# EAGLE design 6to10 (EAGLE 6.5.0)
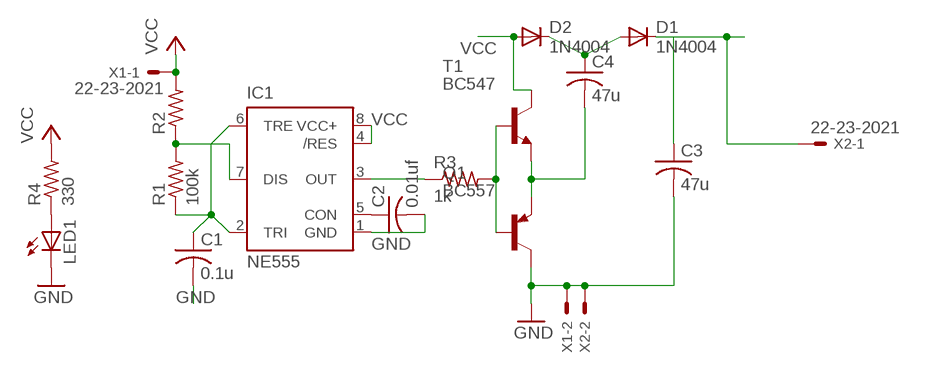
[diagram p0: schematic, sheet 1]

## Parts
C1  0.1u  C-US050-025X075  [C050-025X075]
C2  0.01uf  C-US050-025X075  [C050-025X075]
C3  47u  C-US050-075X075  [C050-075X075]
C4  47u  C-US050-075X075  [C050-075X075]
D1  1N4004  [DO41-10]
D2  1N4004  [DO41-10]
IC1  NE555  [DIL-08]
LED1  LED5MM  [LED5MM]
Q1  BC557  [TO92]
R1  100k  R-US_0204/7  [0204/7]
R2  R-US_0204/7  [0204/7]
R3  1k  R-US_0204/7  [0204/7]
R4  330  R-US_0204/7  [0204/7]
T1  BC547  [TO92]
X1  22-23-2021  [22-23-2021]
X2  22-23-2021  [22-23-2021]

## Nets
GND: C1.2 C2.2 C3.2 IC1.1(GND) LED1.K(C) Q1.3(C) X1.2 X2.2
N$1: C1.1 IC1.2(TRI) IC1.6(TRE) R1.1
N$2: C2.1 IC1.5(CON)
N$3: IC1.7(DIS) R1.2 R2.1
N$4: IC1.3(OUT) R3.1
N$5: C4.1 D1.A D2.C
N$6: C3.1 D1.C X2.1
N$7: Q1.2(B) R3.2 T1.2(B)
N$8: C4.2 Q1.1(E) T1.1(E)
N$9: LED1.A R4.1
VCC: D2.A IC1.4(/RES) IC1.8(VCC+) R2.2 R4.2 T1.3(C) X1.1

## Library data of the parts
C1-C4 = rcl:C-US: CAPACITOR, American symbol
D1 D2 = diode:1N4004: DIODE general purpose rectifier, 1 A
IC1 = st-microelectronics:NE555: General purpose bipolar Timer; MF: Arrow Electronics; MPN: NE555N; OC_FARNELL: 1467742; OC_NEWARK: 89K1486
LED1 = led:LED: LED OSRAM: - CHIPLED LG R971, LG N971, LY N971, LG Q971, LY Q971, LO R971, LY R971 LH N974, LH R974 LS Q976, LO Q976, LY Q976 LO Q996 - Hyper CHIPLED LW Q18S LB Q993, LB Q99A, LB R99A - SideLED LS A670, LO A670, LY A670, LG A670, LP A670 LB A673, LV A673, LT A673, LW A673 LH A674 LY A675 LS A676, LA A676, LO A676, LY A676, LW A676 LS A679, LY A679, LG A679 - Hyper Micro SIDELED® LS Y876, LA Y876, LO Y876, LY Y876 LT Y87S - SmartLED LW L88C, LW L88S LB L89C, LB L89S, LG L890 LS L89K, LO L89K, LY L89K LS L896, LA L896, LO L896, LY L896 - TOPLED LS T670, LO T670, LY T670, LG T670, LP T670 LSG T670, LSP T670, LSY T670, LOP T670, LYG T670 LG T671, LOG T671, LSG T671 LB T673, LV T673, LT T673, LW T673 LH T674 LS T676, LA T676, LO T676, LY T676, LB T676, LH T676, LSB T676, LW T676 LB T67C, LV T67C, LT T67C, LS T67K, LO T67K, LY T67K, LW E67C LS E67B, LA E67B, LO E67B, LY E67B, LB E67C, LV E67C, LT E67C LW T67C LS T679, LY T679, LG T679 LS T770, LO T770, LY T770, LG T770, LP T770 LB T773, LV T773, LT T773, LW T773 LH T774 LS E675, LA E675, LY E675, LS T675 LS T776, LA T776, LO T776, LY T776, LB T776 LHGB T686 LT T68C, LB T68C - Hyper Mini TOPLED® LB M676 - Mini TOPLED Santana® LG M470 LS M47K, LO M47K, LY M47K Source: http://www.osram.convergy.de LUXEON: - LUMILED® LXK2-PW12-R00, LXK2-PW12-S00, LXK2-PW14-U00, LXK2-PW14-V00 LXK2-PM12-R00, LXK2-PM12-S00, LXK2-PM14-U00 LXK2-PE12-Q00, LXK2-PE12-R00, LXK2-PE12-S00, LXK2-PE14-T00, LXK2-PE14-U00 LXK2-PB12-K00, LXK2-PB12-L00, LXK2-PB12-M00, LXK2-PB14-N00, LXK2-PB14-P00, LXK2-PB14-Q00 LXK2-PR12-L00, LXK2-PR12-M00, LXK2-PR14-Q00, LXK2-PR14-R00 LXK2-PD12-Q00, LXK2-PD12-R00, LXK2-PD12-S00 LXK2-PH12-R00, LXK2-PH12-S00 LXK2-PL12-P00, LXK2-PL12-Q00, LXK2-PL12-R00 Source: www.luxeon.com KINGBRIGHT: KA-3528ASYC Source: www.kingbright.com
Q1 = transistor-pnp:BC557: PNP Transistor
R1-R4 = rcl:R-US_: RESISTOR, American symbol
T1 = transistor:BC547: NPN TRANSISTOR
X1 X2 = con-molex:22-23-2021: .100" (2.54mm) Center Header - 2 Pin; MF: MOLEX; MPN: 22-23-2021; OC_FARNELL: 1462926; OC_NEWARK: 25C3832

## Board
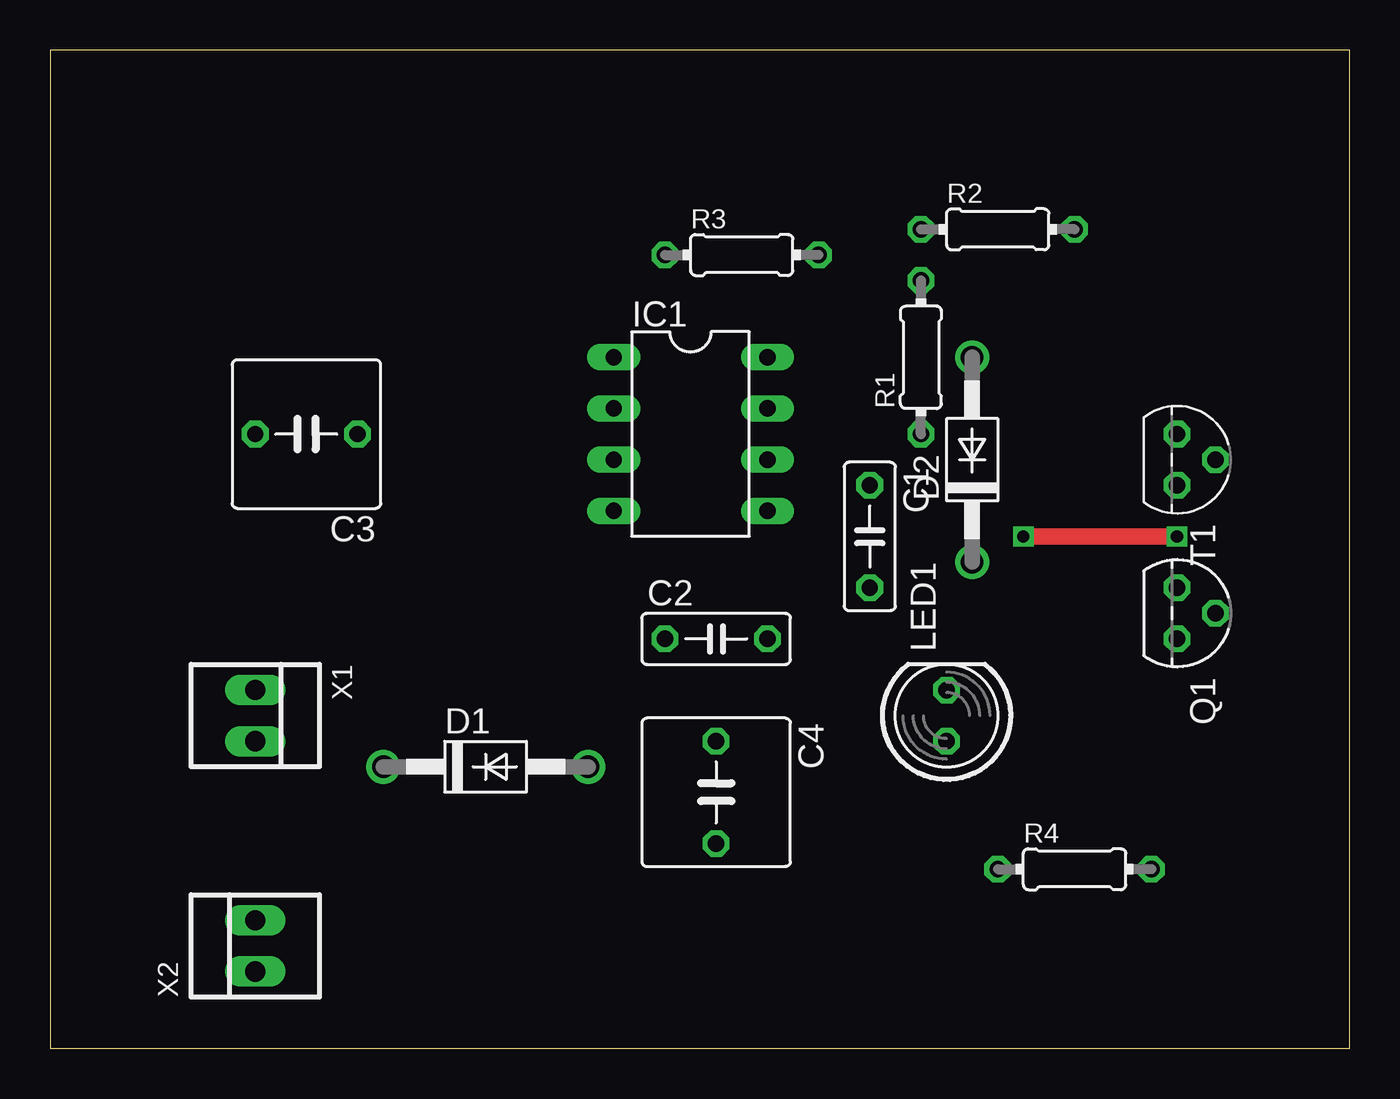
[diagram p1: board, top side]
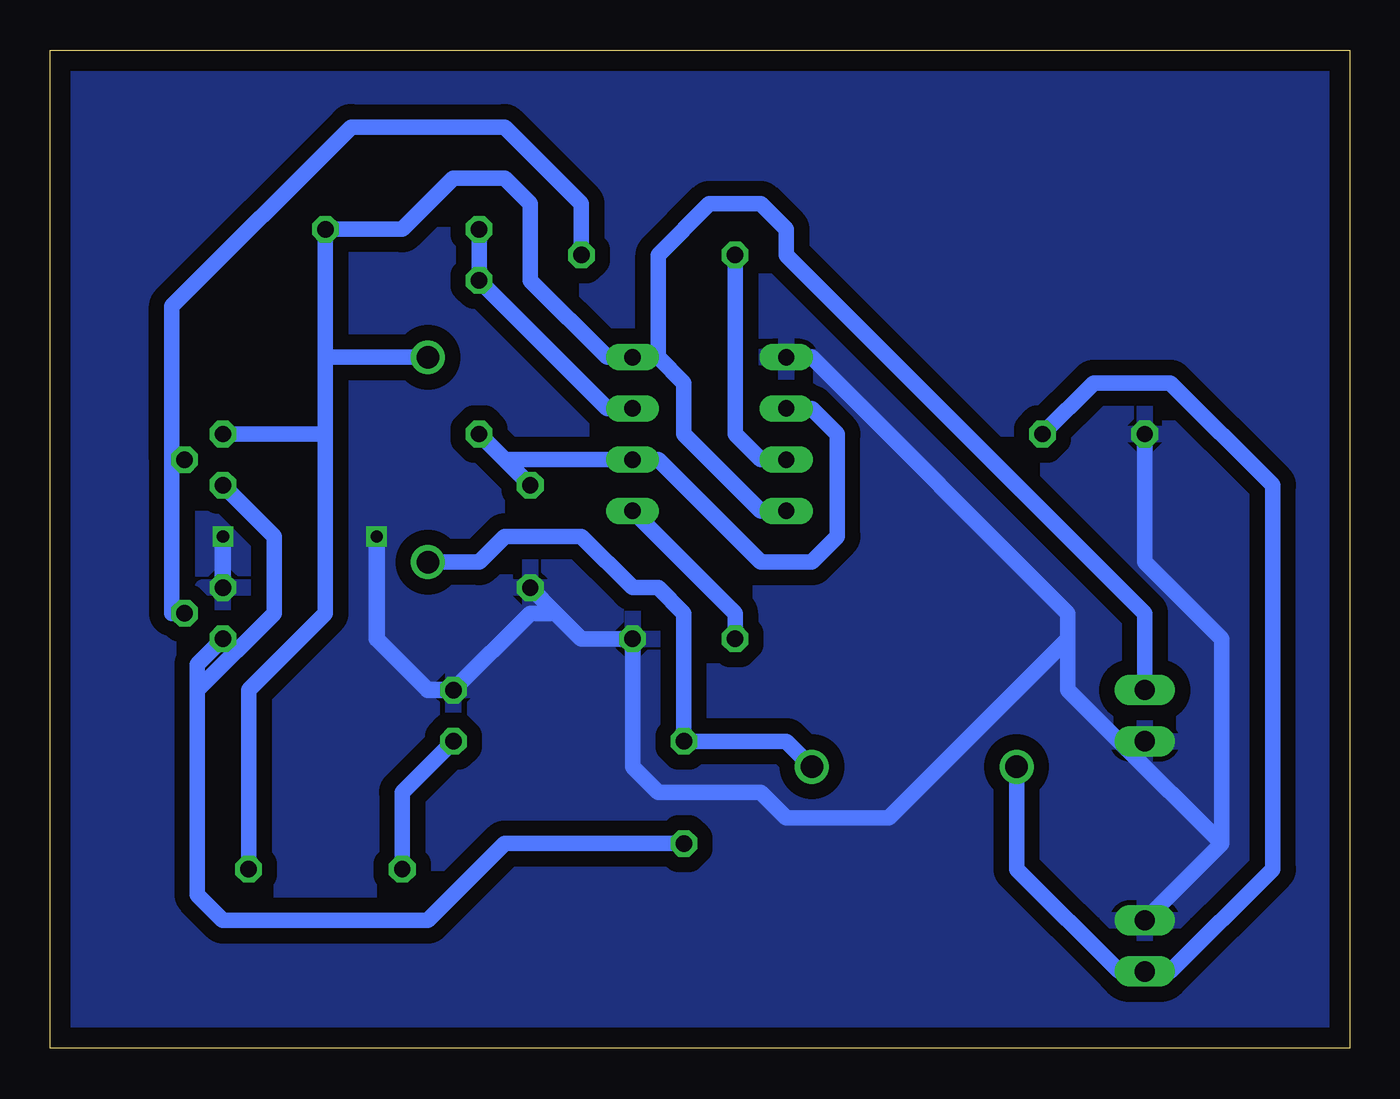
[diagram p2: board, bottom side, seen from below]

Size 64.44 x 49.52 mm. Coordinates in mm from the lower left corner, seen from the top.
Outline: 0,0 64.44,0 64.44,49.52 0,49.52 0,0
Copper layers (1*16): Top 0.035mm / dielectric 1.5mm / Bottom 0.035mm
Design rules "default *": minimum track width 30mil, minimum drill 25mil, track to track 30mil, track to pad 30mil, pad to pad 8mil, via to via 8mil, smd to smd 8mil, copper to edge 40mil, drill to drill 8mil, minimum pad ring 10mil, minimum via ring 8mil, stop-mask expansion 4mil, vias tented up to drill 0mil, thermal gap 10mil

### Footprints (pad centres in the part's own frame; a part is rotated, then mirrored left to right if it is on the bottom)
C050-025X075 = drill 0.813 octagon: 1 -2.54,0; 2 2.54,0
C050-075X075 = drill 0.813 octagon: 1 -2.54,0; 2 2.54,0
DO41-10 = drill 1.118: A 5.08,0; C -5.08,0
DIL-08 = drill 0.813 long: 1 -3.81,-3.81; 2 -1.27,-3.81; 3 1.27,-3.81; 4 3.81,-3.81; 5 3.81,3.81; 6 1.27,3.81; 7 -1.27,3.81; 8 -3.81,3.81
LED5MM = drill 0.813 octagon: A -1.27,0; K 1.27,0
TO92 = drill 0.813 octagon: 1 1.27,0; 2 0,1.905; 3 -1.27,0
0204/7 = drill 0.813 octagon: 1 -3.81,0; 2 3.81,0
22-23-2021 = drill 1 long: 1 -1.27,0; 2 1.27,0

### Placement (x,y rotation side)
C1  40.64,25.4 270 top
C2  33.02,20.32 0 top
C3  12.7,30.48 180 top
C4  33.02,12.7 270 top
D1  21.59,13.97 0 top
D2  45.72,29.21 90 top
IC1  31.75,30.48 270 top
LED1  44.45,16.51 90 top
Q1  55.88,21.59 270 top
R1  43.18,34.29 90 top
R2  46.99,40.64 0 top
R3  34.29,39.37 0 top
R4  50.8,8.89 0 top
T1  55.88,29.21 270 top
X1  10.16,16.51 270 top
X2  10.16,5.08 90 top

### Tracks (layer width: path | path; a pad name or v marks a point on that pad's centre or on a via)
GND  (via drill 0.6)
  Top 0.813: v48.26,25.4 v55.88,25.4
  Bottom 0.762: C1.2 39.37,21.59 | 39.37,21.59 38.1,20.32 C2.2 35.56,13.97 34.29,12.7 29.21,12.7 27.94,11.43 22.86,11.43 13.97,20.32 | LED1.K 40.64,21.59 39.37,21.59 | C3.2 10.16,24.13 6.35,20.32 6.35,10.16 | X2.2 6.35,10.16 | IC1.1 26.67,34.29 13.97,21.59 13.97,20.32 | 13.97,20.32 13.97,17.78 11.43,15.24 | 6.35,10.16 11.43,15.24 | 11.43,15.24 X1.2
  Bottom 0.813: Q1.3 v55.88,25.4 | LED1.K 45.72,17.78 48.26,20.32 v48.26,25.4
  pour Bottom: 0,49.53 64.77,49.53 64.77,0 0,0
N$1
  Bottom 0.762: R1.1 41.91,29.21 | 41.91,29.21 C1.1 | 41.91,29.21 IC1.6 34.29,29.21 29.21,24.13 26.67,24.13 25.4,25.4 25.4,30.48 26.67,31.75 IC1.2
N$2
  Bottom 0.762: C2.1 30.48,21.59 IC1.5
N$3
  Bottom 0.762: IC1.7 36.83,31.75 R1.2 R2.1
N$4
  Bottom 0.762: IC1.3 29.21,29.21 30.48,30.48 R3.1
N$5
  Bottom 0.762: D1.A 27.94,15.24 C4.1 33.02,21.59 34.29,22.86 35.56,22.86 38.1,25.4 41.91,25.4 43.18,24.13 D2.C
N$6
  Bottom 0.762: C3.1 12.7,33.02 8.89,33.02 3.81,27.94 3.81,8.89 8.89,3.81 X2.1 11.43,3.81 16.51,8.89 D1.C
N$7
  Bottom 0.762: R3.2 38.1,41.91 41.91,45.72 49.53,45.72 58.42,36.83 58.42,29.21 | 58.42,29.21 58.42,21.59 Q1.2 | 58.42,29.21 T1.2
N$8
  Bottom 0.762: C4.2 41.91,10.16 45.72,6.35 55.88,6.35 57.15,7.62 57.15,17.78 | 57.15,17.78 57.15,19.05 Q1.1 | T1.1 53.34,25.4 53.34,21.59 57.15,17.78
N$9
  Bottom 0.762: R4.1 46.99,12.7 LED1.A
VCC
  Bottom 0.762: R4.2 54.61,17.78 50.8,21.59 50.8,30.48 | 50.8,34.29 R2.2 46.99,40.64 44.45,43.18 41.91,43.18 40.64,41.91 40.64,38.1 36.83,34.29 IC1.8 34.29,34.29 | 50.8,34.29 50.8,30.48 | 50.8,30.48 T1.3 | 50.8,34.29 D2.A | IC1.4 29.21,26.67 33.02,30.48 33.02,33.02 34.29,34.29 | X1.1 10.16,21.59 27.94,39.37 27.94,40.64 29.21,41.91 31.75,41.91 34.29,39.37 34.29,34.29